# Altium project Frame13ProDock.PrjPcb
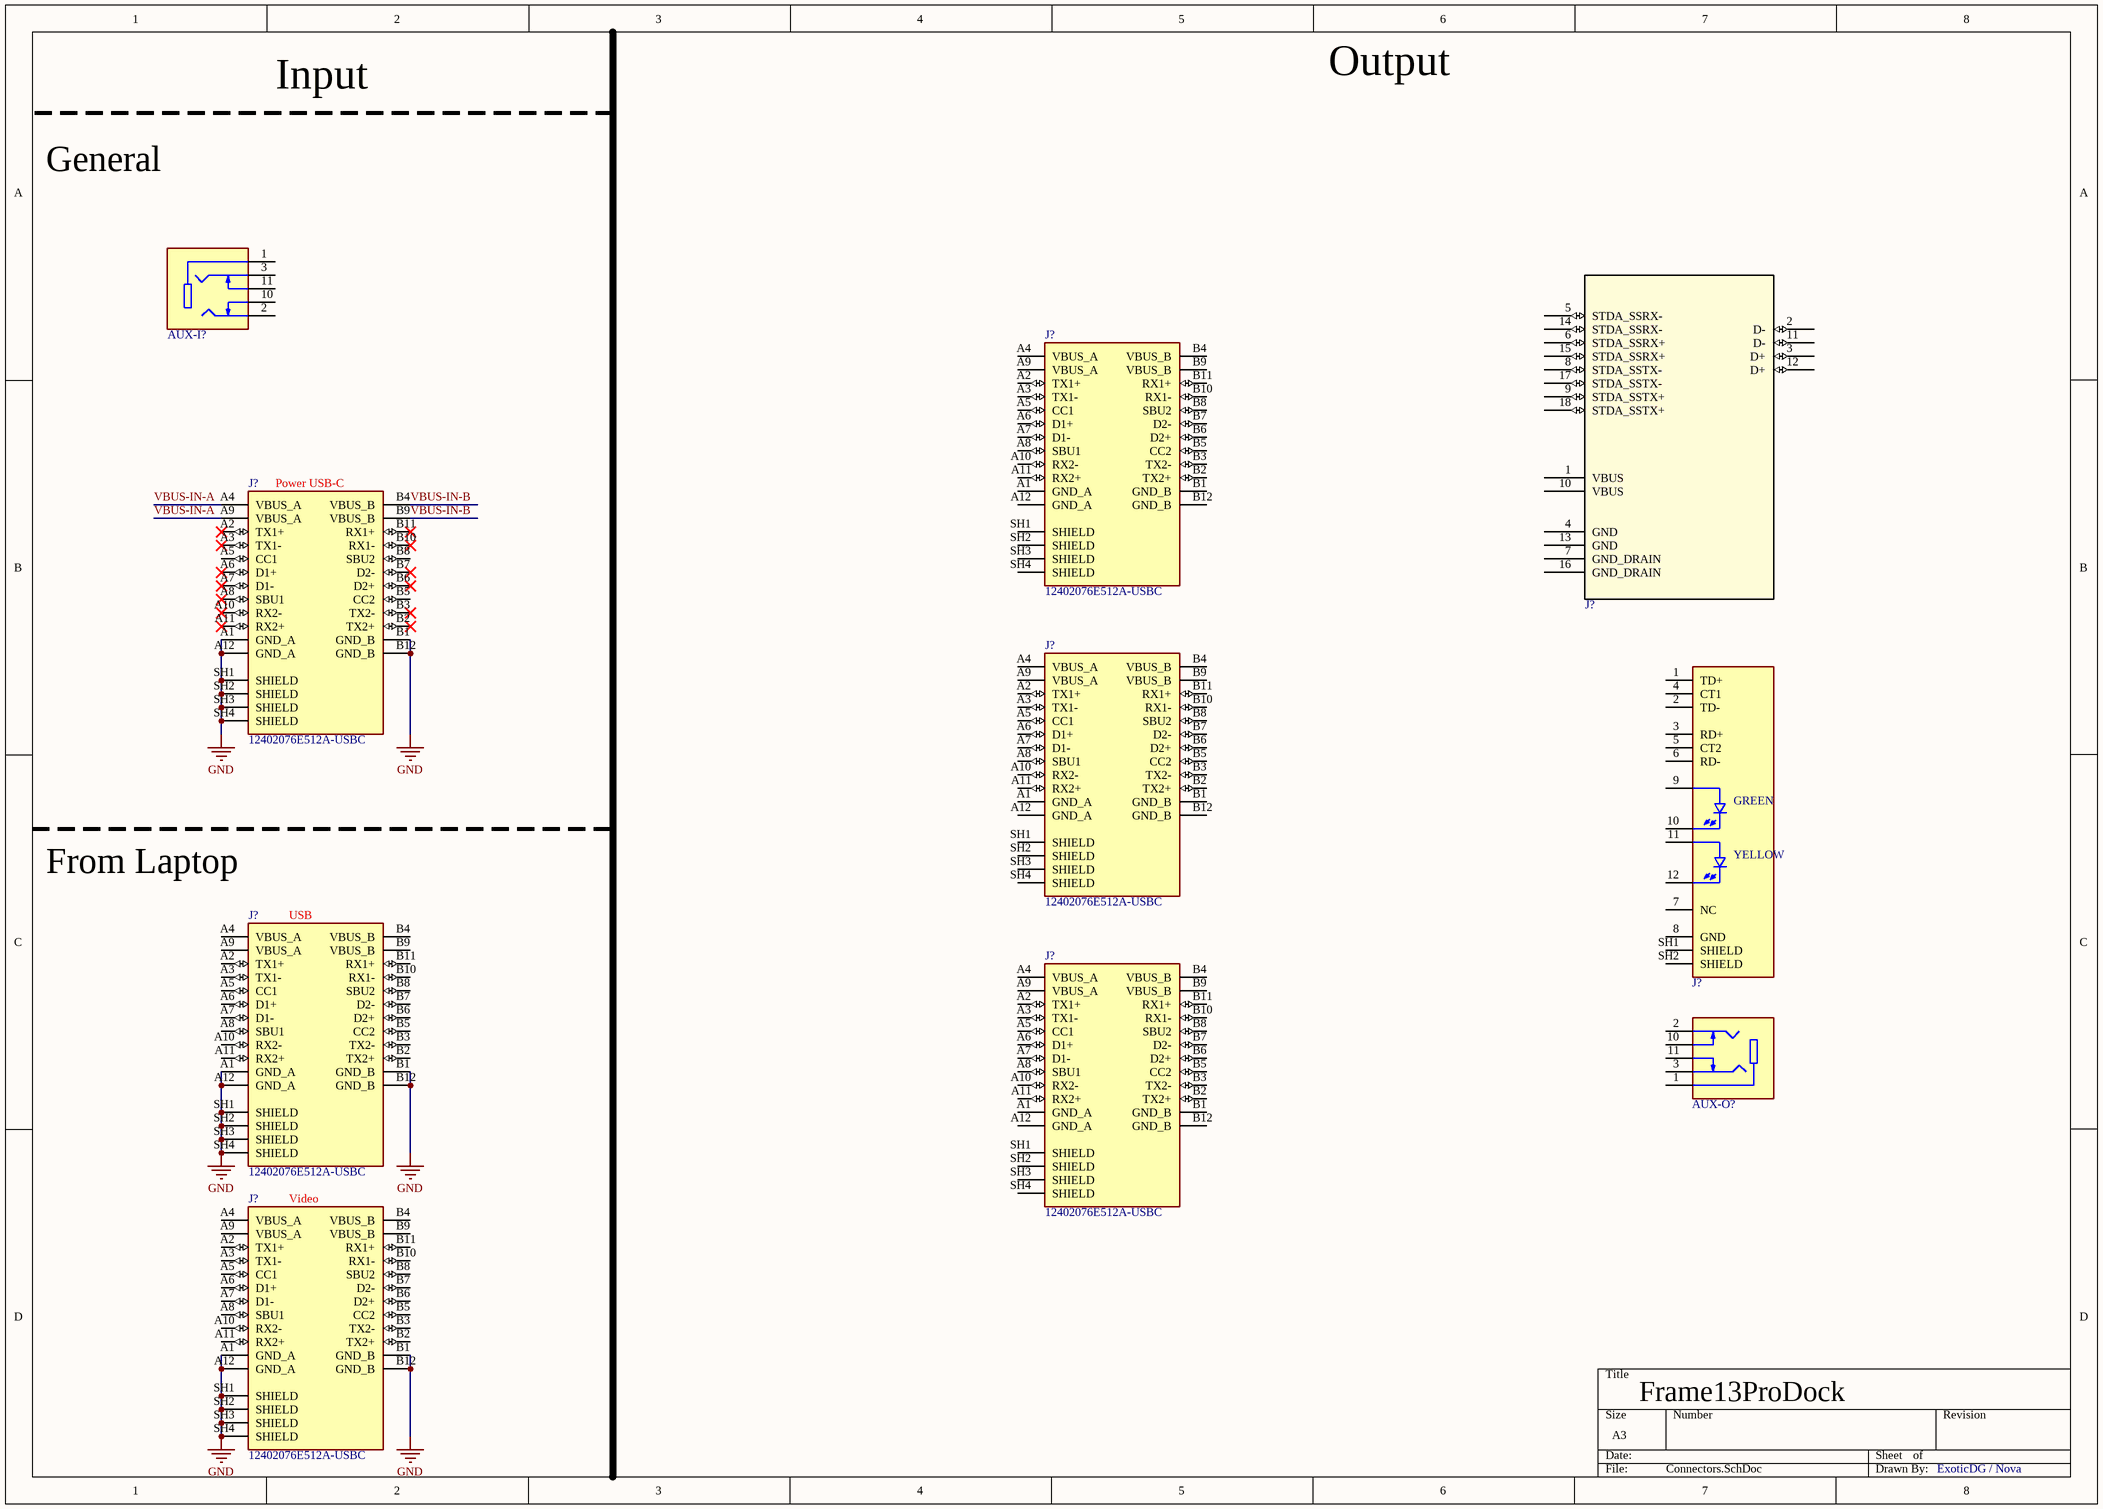
[diagram p0: Connectors.SchDoc]
5 sheets, 13 parts. Net scope: global (net labels, ports and power ports of the same name join across sheets).
Board file: PCB.PcbDoc
Sheets:
  Master.SchDoc
  Power.SchDoc
  Connectors.SchDoc
  USB.SchDoc
  Display.SchDoc

## Sheet Master.SchDoc: Frame13ProDock
size A3; Author: ExoticDG / Nova; DrawnBy: ExoticDG / Nova; Engineer: ExoticDG / Nova; SheetNumber: 1; SheetTotal: 1

## Sheet Power.SchDoc
size A3; SheetNumber: 2; SheetTotal: 2

## Sheet Connectors.SchDoc: Frame13ProDock
size A3; DrawnBy: ExoticDG / Nova; SheetNumber: 3; SheetTotal: 5

### Parts
(Parts that share a designator on the sheet are numbered #1, #2 ... from top to bottom, then left to right.)
AUX-I?  SJ1-3525NG-PI  [SJ1-3525NG-PI]  (value not drawn)
AUX-O?  SJ1-3525NG-GR  [SJ1-3525NG-GR]  (value not drawn)
J?#1  0484060003-USBA-Dual-Stack  [0484060003-USBA-Dual-Stack]  (value not drawn)
J?#2  12402076E512A-USBC  [12402076E512A-USBC]
J?#3  12402076E512A-USBC  [12402076E512A-USBC]
J?#4  12402076E512A-USBC  [12402076E512A-USBC]
J?#5  ARJM11D7-009-AB-EW2-ETHERNET  [ARJM11D7-009-AB-EW2-ETHERNET]  (value not drawn)
J?#6  12402076E512A-USBC  [12402076E512A-USBC]
J?#7  12402076E512A-USBC  [12402076E512A-USBC]
J?#8  12402076E512A-USBC  [12402076E512A-USBC]

### Nets
GND: J?#3.A1(GND_A) J?#3.A12(GND_A) J?#3.B1(GND_B) J?#3.B12(GND_B) J?#3.SH1(SHIELD) J?#3.SH2(SHIELD) J?#3.SH3(SHIELD) J?#3.SH4(SHIELD) J?#6.A1(GND_A) J?#6.A12(GND_A) J?#6.B1(GND_B) J?#6.B12(GND_B) J?#6.SH1(SHIELD) J?#6.SH2(SHIELD) J?#6.SH3(SHIELD) J?#6.SH4(SHIELD) J?#8.A1(GND_A) J?#8.A12(GND_A) J?#8.B1(GND_B) J?#8.B12(GND_B) J?#8.SH1(SHIELD) J?#8.SH2(SHIELD) J?#8.SH3(SHIELD) J?#8.SH4(SHIELD)
VBUS-IN-A: J?#3.A4(VBUS_A) J?#3.A9(VBUS_A)
VBUS-IN-B: J?#3.B4(VBUS_B) J?#3.B9(VBUS_B)

Not connected (* = marked no-connect by the designer): AUX-I? 1 2 3 10 11; AUX-O? 1 2 3 10 11; J?#1 1(VBUS) 2(D-) 3(D+) 4(GND) 5(STDA_SSRX-) 6(STDA_SSRX+) 7(GND_DRAIN) 8(STDA_SSTX-) 9(STDA_SSTX+) 10(VBUS) 11(D-) 12(D+) 13(GND) 14(STDA_SSRX-) 15(STDA_SSRX+) 16(GND_DRAIN) 17(STDA_SSTX-) 18(STDA_SSTX+); J?#2 A1(GND_A) A2(TX1+) A3(TX1-) A4(VBUS_A) A5(CC1) A6(D1+) A7(D1-) A8(SBU1) A9(VBUS_A) A10(RX2-) A11(RX2+) A12(GND_A) B1(GND_B) B2(TX2+) B3(TX2-) B4(VBUS_B) B5(CC2) B6(D2+) B7(D2-) B8(SBU2) B9(VBUS_B) B10(RX1-) B11(RX1+) B12(GND_B) SH1(SHIELD) SH2(SHIELD) SH3(SHIELD) SH4(SHIELD); J?#3 A2(TX1+)* A3(TX1-)* A5(CC1) A6(D1+)* A7(D1-)* A8(SBU1)* A10(RX2-)* A11(RX2+)* B2(TX2+)* B3(TX2-)* B5(CC2) B6(D2+)* B7(D2-)* B8(SBU2) B10(RX1-)* B11(RX1+)*; J?#4 A1(GND_A) A2(TX1+) A3(TX1-) A4(VBUS_A) A5(CC1) A6(D1+) A7(D1-) A8(SBU1) A9(VBUS_A) A10(RX2-) A11(RX2+) A12(GND_A) B1(GND_B) B2(TX2+) B3(TX2-) B4(VBUS_B) B5(CC2) B6(D2+) B7(D2-) B8(SBU2) B9(VBUS_B) B10(RX1-) B11(RX1+) B12(GND_B) SH1(SHIELD) SH2(SHIELD) SH3(SHIELD) SH4(SHIELD); J?#5 1(TD+) 2(TD-) 3(RD+) 4(CT1) 5(CT2) 6(RD-) 7(NC) 8(GND) 9 10 11 12 SH1(SHIELD) SH2(SHIELD); J?#6 A2(TX1+) A3(TX1-) A4(VBUS_A) A5(CC1) A6(D1+) A7(D1-) A8(SBU1) A9(VBUS_A) A10(RX2-) A11(RX2+) B2(TX2+) B3(TX2-) B4(VBUS_B) B5(CC2) B6(D2+) B7(D2-) B8(SBU2) B9(VBUS_B) B10(RX1-) B11(RX1+); J?#7 A1(GND_A) A2(TX1+) A3(TX1-) A4(VBUS_A) A5(CC1) A6(D1+) A7(D1-) A8(SBU1) A9(VBUS_A) A10(RX2-) A11(RX2+) A12(GND_A) B1(GND_B) B2(TX2+) B3(TX2-) B4(VBUS_B) B5(CC2) B6(D2+) B7(D2-) B8(SBU2) B9(VBUS_B) B10(RX1-) B11(RX1+) B12(GND_B) SH1(SHIELD) SH2(SHIELD) SH3(SHIELD) SH4(SHIELD); J?#8 A2(TX1+) A3(TX1-) A4(VBUS_A) A5(CC1) A6(D1+) A7(D1-) A8(SBU1) A9(VBUS_A) A10(RX2-) A11(RX2+) B2(TX2+) B3(TX2-) B4(VBUS_B) B5(CC2) B6(D2+) B7(D2-) B8(SBU2) B9(VBUS_B) B10(RX1-) B11(RX1+)

### Notes on the sheet
- Input
- Output
- General
- (near J?#3) Power USB-C
- From Laptop
- (near J?#6) USB
- (near J?#8) Video
- (in symbol ARJM11D7-009-AB-EW2-ETHERNET) GREEN; YELLOW

### Library data of the parts
AUX-I? = SJ1-3525NG-PI: Stereo audio input via a 3.5mm AUX connector / 3.5 mm, Stereo, Right Angle, Through Hole, Isolated Ground, 3 Conductors, 2 Internal Switches, Audio Jack Connector / https://www.digikey.com/en/products/detail/same-sky-formerly-cui-devices/SJ1-3525NG-GR/2295990; ComponentLink1Description: Digikey; ComponentLink1URL: https://www.digikey.com/en/products/detail/same-sky-formerly-cui-devices/SJ1-3525NG-PI/2295991
AUX-O? = SJ1-3525NG-GR: Stereo audio output via a 3.5mm AUX connector / 3.5 mm, Stereo, Right Angle, Through Hole, Isolated Ground, 3 Conductors, 2 Internal Switches, Audio Jack Connector / https://www.digikey.com/en/products/detail/same-sky-formerly-cui-devices/SJ1-3525NG-GR/2295990; ComponentLink1Description: Digikey; ComponentLink1URL: https://www.digikey.com/en/products/detail/same-sky-formerly-cui-devices/SJ1-3525NG-GR/2295990
J?#1 = 0484060003-USBA-Dual-Stack: Universal Serial Bus (USB 3.0) I/O Receptacle, Dual Port Stacked, Right-Angle, Type A, High-Temperature Blue Nylon, 0.38Âµm Gold (Au) Plating, Contact Height 4.13mm; ComponentLink1Description: Digikey; ComponentLink1URL: https://www.digikey.com/en/products/detail/molex/0484060003/4701516
J?#2-J?#4 J?#6-J?#8 = 12402076E512A-USBC: USB CONN, 4.0 TYPE C, R/A RCPT, 24P, SMT; USB Connector Type: USB Type C; USB Standard: USB 4.0; Gender: Receptacle; No. of Positions: 24Positions; Connector Mounting: Surface Mount, Through Hole Mount; Or 79AJ9108; ComponentLink1Description: Digikey; ComponentLink1URL: https://www.digikey.com/en/products/detail/amphenol-cs-commercial-products/12402076E512A/15926893
J?#5 = ARJM11D7-009-AB-EW2-ETHERNET: ComponentLink1Description: Digikey; ComponentLink1URL: https://www.digikey.com/en/products/detail/abracon-llc/ARJM11D7-009-AB-EW2/7675229

## Sheet USB.SchDoc
size A3; SheetNumber: 4; SheetTotal: 4
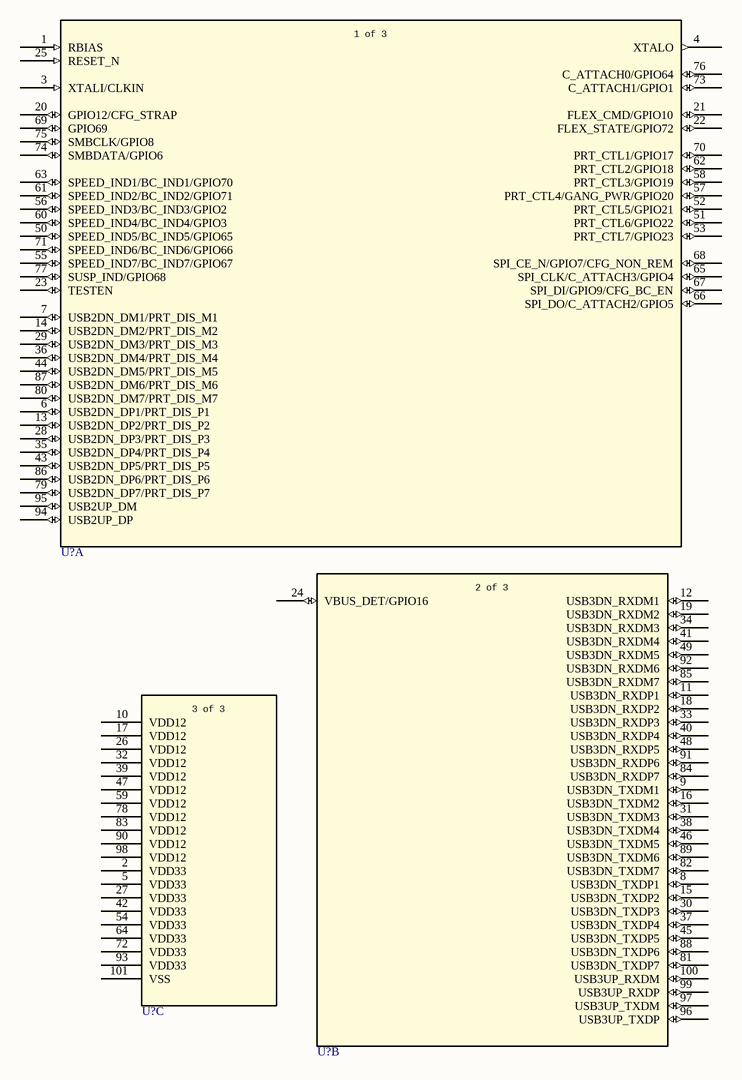
[diagram p1: USB.SchDoc]

### Parts
(Parts that share a designator on the sheet are numbered #1, #2 ... from top to bottom, then left to right.)
U?#1  USB5807C/KD  [VQFN100_KDX_MCH]  (value not drawn)  (part A of 3)
U?#2  USB5807C/KD  [VQFN100_KDX_MCH]  (value not drawn)  (part B of 3)
U?#3  USB5807C/KD  [VQFN100_KDX_MCH]  (value not drawn)  (part C of 3)

### Nets

Not connected (* = marked no-connect by the designer): U?#1 1(RBIAS) 3(XTALI/CLKIN) 4(XTALO) 6(USB2DN_DP1/PRT_DIS_P1) 7(USB2DN_DM1/PRT_DIS_M1) 13(USB2DN_DP2/PRT_DIS_P2) 14(USB2DN_DM2/PRT_DIS_M2) 20(GPIO12/CFG_STRAP) 21(FLEX_CMD/GPIO10) 22(FLEX_STATE/GPIO72) 23(TESTEN) 25(RESET_N) 28(USB2DN_DP3/PRT_DIS_P3) 29(USB2DN_DM3/PRT_DIS_M3) 35(USB2DN_DP4/PRT_DIS_P4) 36(USB2DN_DM4/PRT_DIS_M4) 43(USB2DN_DP5/PRT_DIS_P5) 44(USB2DN_DM5/PRT_DIS_M5) 50(SPEED_IND5/BC_IND5/GPIO65) 51(PRT_CTL6/GPIO22) 52(PRT_CTL5/GPIO21) 53(PRT_CTL7/GPIO23) 55(SPEED_IND7/BC_IND7/GPIO67) 56(SPEED_IND3/BC_IND3/GPIO2) 57(PRT_CTL4/GANG_PWR/GPIO20) 58(PRT_CTL3/GPIO19) 60(SPEED_IND4/BC_IND4/GPIO3) 61(SPEED_IND2/BC_IND2/GPIO71) 62(PRT_CTL2/GPIO18) 63(SPEED_IND1/BC_IND1/GPIO70) 65(SPI_CLK/C_ATTACH3/GPIO4) 66(SPI_DO/C_ATTACH2/GPIO5) 67(SPI_DI/GPIO9/CFG_BC_EN) 68(SPI_CE_N/GPIO7/CFG_NON_REM) 69(GPIO69) 70(PRT_CTL1/GPIO17) 71(SPEED_IND6/BC_IND6/GPIO66) 73(C_ATTACH1/GPIO1) 74(SMBDATA/GPIO6) 75(SMBCLK/GPIO8) 76(C_ATTACH0/GPIO64) 77(SUSP_IND/GPIO68) 79(USB2DN_DP7/PRT_DIS_P7) 80(USB2DN_DM7/PRT_DIS_M7) 86(USB2DN_DP6/PRT_DIS_P6) 87(USB2DN_DM6/PRT_DIS_M6) 94(USB2UP_DP) 95(USB2UP_DM); U?#2 8(USB3DN_TXDP1) 9(USB3DN_TXDM1) 11(USB3DN_RXDP1) 12(USB3DN_RXDM1) 15(USB3DN_TXDP2) 16(USB3DN_TXDM2) 18(USB3DN_RXDP2) 19(USB3DN_RXDM2) 24(VBUS_DET/GPIO16) 30(USB3DN_TXDP3) 31(USB3DN_TXDM3) 33(USB3DN_RXDP3) 34(USB3DN_RXDM3) 37(USB3DN_TXDP4) 38(USB3DN_TXDM4) 40(USB3DN_RXDP4) 41(USB3DN_RXDM4) 45(USB3DN_TXDP5) 46(USB3DN_TXDM5) 48(USB3DN_RXDP5) 49(USB3DN_RXDM5) 81(USB3DN_TXDP7) 82(USB3DN_TXDM7) 84(USB3DN_RXDP7) 85(USB3DN_RXDM7) 88(USB3DN_TXDP6) 89(USB3DN_TXDM6) 91(USB3DN_RXDP6) 92(USB3DN_RXDM6) 96(USB3UP_TXDP) 97(USB3UP_TXDM) 99(USB3UP_RXDP) 100(USB3UP_RXDM); U?#3 2(VDD33) 5(VDD33) 10(VDD12) 17(VDD12) 26(VDD12) 27(VDD33) 32(VDD12) 39(VDD12) 42(VDD33) 47(VDD12) 54(VDD33) 59(VDD12) 64(VDD33) 72(VDD33) 78(VDD12) 83(VDD12) 90(VDD12) 93(VDD33) 98(VDD12) 101(VSS)

### Notes on the sheet
- (in symbol USB5807CKD, part A) 1 of 3
- (in symbol USB5807CKD, part B) 2 of 3
- (in symbol USB5807CKD, part C) 3 of 3

### Library data of the parts
U?#1-U?#3 = USB5807CKD: IC USB HUB CNTRL I2C/SPI 100VQFN 7port USB 3.2 hub; Manufacturer_Name: Microchip; Copyright: Copyright (C) 2026 Ultra Librarian. All rights reserved.; Manufacturer_Part_Number: USB5807C/KD; RefDes: RefDes; Type: Type; ComponentLink1Description: Digikey; ComponentLink1URL: https://www.digikey.com/en/products/detail/microchip-technology/USB5807C-KD/10231377

## Sheet Display.SchDoc
size A3; SheetNumber: 5; SheetTotal: 5